# Altium schematic sheet Encoder.SchDoc
size A; SheetNumber: 6; SheetTotal: 9
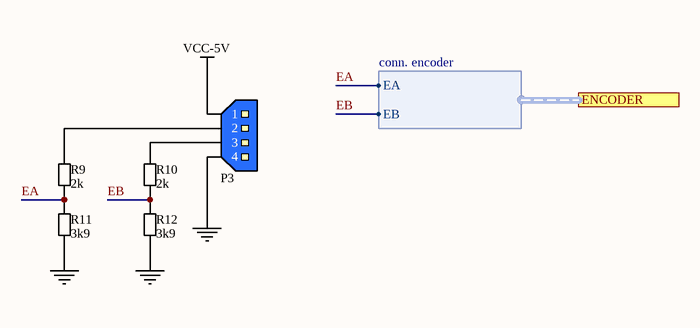
[diagram p0: Encoder.SchDoc]

## Parts
P3  TE CONNECTIVITY_4PIN_MALE  [TE CONNECTIVITY_4PIN_MALE]  (value not drawn)
R9  2k  [RESC2013X38N-0805-NOOVERLAY]
R10  2k  [RESC2013X38N-0805-NOOVERLAY]
R11  3k9  [RESC2013X38N-0805-NOOVERLAY]
R12  3k9  [RESC2013X38N-0805-NOOVERLAY]

## Ports
ENCODER (harness conn. encoder)

## Harnesses
conn. encoder: EA, EB

## Nets
GND: P3.4 R11.1 R12.1
VCC-5V: P3.1
EA: R9.1 R11.2 ; port ENCODER.EA
EB: R10.1 R12.2 ; port ENCODER.EB
NetP3_2: P3.2 R9.2
NetP3_3: P3.3 R10.2

## Library data of the parts
P3 = TE CONNECTIVITY_4PIN_MALE: BLUE_4PIN_CONECTOR; Manufacturer: TE CONNECTIVITY / AMP; Manufacturer Part Number 1: 281695-3; Order Code 1: 1205983; Price 1: £0.403; Supplier 1: uk.farnell.com
R9 R10 = 00002001: RES SMD 2 kOhm 1/8W 0805; Power: 0.125W, 1/8W; Barcode: 00009101; Resistance: 2k; Assembly: SMD
R11 R12 = 00003901: RES SMD 3.9 kOhm 1/8W 0805; Power: 0.125W, 1/8W; Barcode: 00009101; Resistance: 3k9; Assembly: SMD